# Altium project Crawler_V2.0.PrjPcb
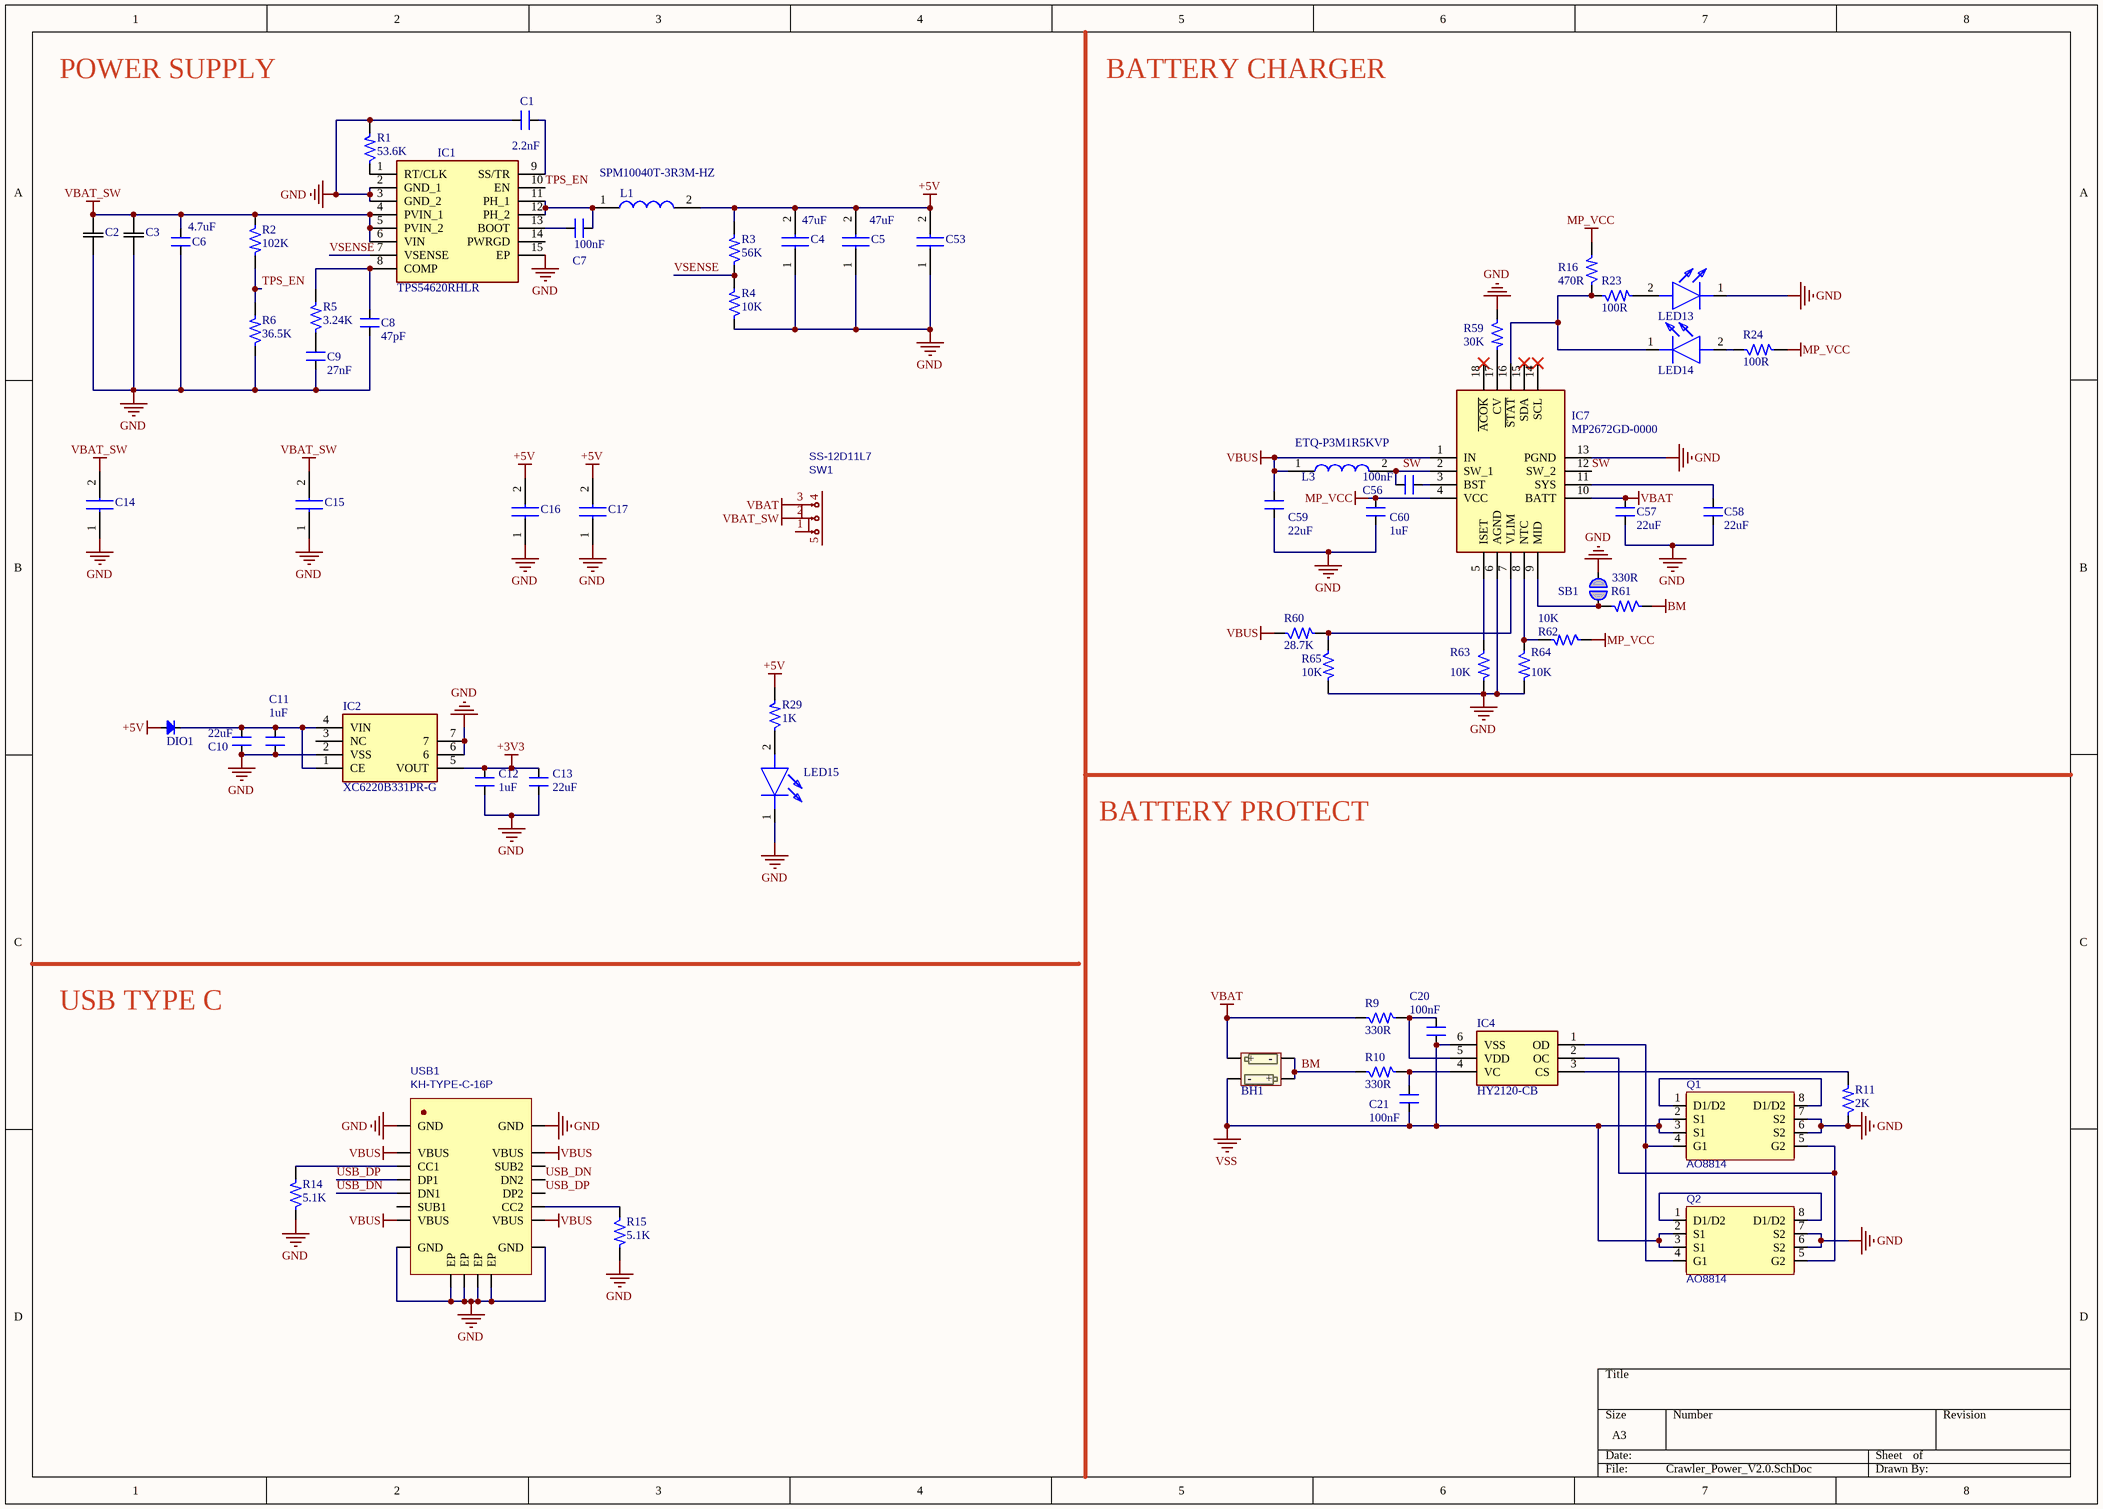
[diagram p0: Crawler_Power_V2.0.SchDoc]
2 sheets, 143 parts. Net scope: global (net labels, ports and power ports of the same name join across sheets).
Board file: Crawler_PCB_V2.0.PcbDoc
Sheets:
  Crawler_Power_V2.0.SchDoc
  Crawler_Sensor_V2.0.SchDoc

## Sheet Crawler_Power_V2.0.SchDoc
size A3; SheetNumber: 1; SheetTotal: 2

### Parts
BH1  Battery Holder  [BH-18650-B1BA007]  (value not drawn)
C1  2.2nF  [CAP_0402]
C2  CC1206MKX5R7BB106  [CAP_CC1206_YAG-M]  (value not drawn)
C3  CC1206MKX5R7BB106  [CAP_CC1206_YAG-M]  (value not drawn)
C4  GRM32ER61C476KE15L  [CAPC3225X270N]  (value not drawn)
C5  GRM32ER61C476KE15L  [CAPC3225X270N]  (value not drawn)
C6  4.7uF  [CAP_0402]
C7  100nF  [CAP_0603]
C8  47pF  [CAP_0402]
C9  27nF  [CAP_0402]
C10  22uF  [CAP_0603]
C11  1uF  [CAP_0402]
C12  1uF  [CAP_0402]
C13  22uF  [CAP_0603]
C14  GRM32ER61C476KE15L  [CAPC3225X270N]  (value not drawn)
C15  GRM32ER61C476KE15L  [CAPC3225X270N]  (value not drawn)
C16  GRM32ER61C476KE15L  [CAPC3225X270N]  (value not drawn)
C17  GRM32ER61C476KE15L  [CAPC3225X270N]  (value not drawn)
C20  100nF  [CAP_0402]
C21  100nF  [CAP_0402]
C53  GRM32ER61C476KE15L  [CAPC3225X270N]  (value not drawn)
C56  100nF  [CAP_0603]
C57  22uF  [CAP_0805]
C58  22uF  [CAP_0805]
C59  22uF  [CAP_0603]
C60  1uF  [CAP_0402]
DIO1  Diode SMD  [DIO-SMD-123]  (value not drawn)
IC1  TPS54620RHLR  [TPS54622RHLR]
IC2  XC6220B331PR-G  [XC6220B331PRG]
IC4  HY2120-CB  [SOT95P280X140-6N]
IC7  MP2672GD-0000  [QFN40P200X300X100-18N-D]
L1  SPM10040T-3R3M-HZ  [SPM10040]
L3  ETQ-P3M1R5KVP  [ETQ-P3M_KVP]
LED13  LTST-C191KGKT  [LEDC1608X55N]  (value not drawn)
LED14  LTST-C190KRKT  [LEDC1608X80N]  (value not drawn)
LED15  LTST-C191KGKT  [LEDC1608X55N]  (value not drawn)
Q1  AO8814  [TSSOP-8_L4.4-W3.0-P0.65-LS6.4-BL]
Q2  AO8814  [TSSOP-8_L4.4-W3.0-P0.65-LS6.4-BL]
R1  53.6K  [RES_0402]
R2  102K  [RES_0402]
R3  56K  [RES_0402]
R4  10K  [RES_0402]
R5  3.24K  [RES_0402]
R6  36.5K  [RES_0402]
R9  330R  [RES_0402]
R10  330R  [RES_0402]
R11  2K  [RES_0402]
R14  5.1K  [RES_0402]
R15  5.1K  [RES_0402]
R16  470R  [RES_0402]
R23  100R  [RES_0402]
R24  100R  [RES_0402]
R29  1K  [RES_0402]
R59  30K  [RES_0402]
R60  28.7K  [RES_0402]
R61  330R  [RES_0402]
R62  10K  [RES_0402]
R63  10K  [RES_0402]
R64  10K  [RES_0402]
R65  10K  [RES_0402]
SB1  Solderbridge  [Solderbridge]  (value not drawn)  (no BOM)
SW1  SS-12D11L7  [SW-TH_XKB_SS-12D11L7]
USB1  KH-TYPE-C-16P  [USB-C-SMD_KH-TYPE-C-16P]

### Nets
+3V3: C12.2 C13.2 IC2.5(VOUT)
+5V: C4.2 C5.2 C16.2 C17.2 C53.2 DIO1.1(A) L1.2 R3.2 R29.2
BM: BH1.2(-) BH1.4(+) R10.1 R61.1
GND: C1.2 C2.1 C3.1 C4.1 C5.1 C6.1 C8.1 C9.1 C10.1 C11.1 C12.1 C13.1 C14.1 C15.1 C16.1 C17.1 C53.1 C57.1 C58.1 C59.1 C60.1 IC1.2(GND_1) IC1.3(GND_2) IC1.15(EP) IC2.2(VSS) IC2.6 IC2.7 IC7.6(AGND) IC7.13(PGND) LED13.1(K) LED15.1(K) Q1.6(S2) Q1.7(S2) Q2.6(S2) Q2.7(S2) R1.2 R4.1 R6.1 R11.1 R14.1 R15.2 R59.1 R63.2 R64.2 R65.2 SB1.2 USB1.1(EP) USB1.2(EP) USB1.3(EP) USB1.4(EP) USB1.A1(GND) USB1.A12(GND) USB1.B1(GND) USB1.B12(GND)
MP_VCC: C60.2 IC7.4(VCC) R16.2 R24.2 R62.1
VBAT: BH1.1(+) C57.2 IC7.10(BATT) R9.1 SW1.3
VBAT_SW: C2.2 C3.2 C6.2 C14.2 C15.2 IC1.4(PVIN_1) IC1.5(PVIN_2) IC1.6(VIN) R2.1 SW1.2
VBUS: C59.2 IC7.1(IN) L3.1 R60.1 USB1.A4(VBUS) USB1.A9(VBUS) USB1.B4(VBUS) USB1.B9(VBUS)
VSS: BH1.3(-) C20.2 C21.1 IC4.6(VSS) Q1.2(S1) Q1.3(S1) Q2.2(S1) Q2.3(S1)
SW: C56.1 IC7.2(SW_1) IC7.12(SW_2) L3.2
TPS_EN: IC1.10(EN) R2.2 R6.2
USB_DN: USB1.A7(DN1) USB1.B7(DN2)
USB_DP: USB1.A6(DP1) USB1.B6(DP2)
VSENSE: IC1.7(VSENSE) R3.1 R4.2
NetC1_1: C1.1 IC1.9(SS/TR)
NetC7_1: C7.1 IC1.13(BOOT)
NetC7_2: C7.2 IC1.11(PH_1) IC1.12(PH_2) L1.1
NetC8_2: C8.2 IC1.8(COMP) R5.2
NetC9_2: C9.2 R5.1
NetC10_2: C10.2 C11.2 DIO1.2(K) IC2.1(CE) IC2.4(VIN)
NetC20_1: C20.1 IC4.5(VDD) R9.2
NetC21_2: C21.2 IC4.4(VC) R10.2
NetC56_2: C56.2 IC7.3(BST)
NetC58_2: C58.2 IC7.11(SYS)
NetIC1_1: IC1.1(RT/CLK) R1.1
NetIC4_1: IC4.1(OD) Q1.4(G1) Q2.4(G1)
NetIC4_2: IC4.2(OC) Q1.5(G2) Q2.5(G2)
NetIC4_3: IC4.3(CS) R11.2
NetIC7_5: IC7.5(ISET) R63.1
NetIC7_7: IC7.7(VLIM) R60.2 R65.1
NetIC7_8: IC7.8(NTC) R62.2 R64.1
NetIC7_9: IC7.9(MID) R61.2 SB1.1
NetIC7_16: IC7.16(~{STAT}) LED14.1(K) R16.1 R23.1
NetIC7_17: IC7.17(CV) R59.2
NetLED13_2: LED13.2(A) R23.2
NetLED14_2: LED14.2(A) R24.1
NetLED15_2: LED15.2(A) R29.1
NetQ1_1: Q1.1(D1/D2) Q1.8(D1/D2)
NetQ2_1: Q2.1(D1/D2) Q2.8(D1/D2)
NetR14_2: R14.2 USB1.A5(CC1)
NetR15_1: R15.1 USB1.B5(CC2)

Not connected (* = marked no-connect by the designer): IC1 14(PWRGD); IC2 3(NC); IC7 14(SCL)* 15(SDA)* 18(~{ACOK})*; SW1 1 4 5; USB1 A8(SUB1) B8(SUB2)

### Notes on the sheet
- POWER SUPPLY
- BATTERY CHARGER
- (near C4) 47uF
- (near C5) 47uF
- BATTERY PROTECT
- USB TYPE C

### Library data of the parts
BH1 = BH-18650-B1BA007
C1 = CAP_220pF-10V-10%-0402: 2.2nF ±10% 50V Ceramic Capacitor X7R 0402 (1005 Metric); Manufacturer: KEMET; Manufacturer Part Number: C0402C221K8RAC7867; Case/Package: 0402; Supplier-1: Digikey
C2 C3 = CC1206MKX5R7BB106: No Description Available; Mfr_Name: Yageo; Type: DEV; Copyright: Copyright (C) 2023 Ultra Librarian. All rights reserved.; Manufacturer_Part_Number: CC1206MKX5R7BB106; Digi-Key_Part_Number_1: 311-1996-2-ND; Digi-Key_Part_Number_2: 311-1996-1-ND; Digi-Key_Part_Number_3: 311-1996-6-ND; RefDes: RefDes
C4 C5 C14-C17 C53 = GRM32ER61C476KE15L: Capacitor; Manufacturer_Name: Murata Electronics; Datasheet Link: http://psearch.en.murata.com/capacitor/product/GRM32ER71E226KE15%23.pdf; Height: 2.7mm; Manufacturer_Part_Number: GRM32ER61C476KE15L; Arrow Part Number: GRM32ER61C476KE15L; Arrow Price/Stock: https://www.arrow.com/en/products/grm32er61c476ke15l/murata-manufacturing; Mouser Part Number: 81-GRM32ER61C476KE5L; Mouser Price/Stock: https://www.mouser.co.uk/ProductDetail/Murata-Electronics/GRM32ER61C476KE15L?qs=%252B%2F7tQhzlcy7Im%2F1Gh2YSGQ%3D%3D
C6 = CAP_4.7uF-10V-10%-0402: 4.7µF ±10% 10V Ceramic Capacitor X5R 0402 (1005 Metric); Manufacturer: Samsung Electro-Mechanics; Manufacturer Part Number: CL05A475KP5NRNC; Case/Package: 0402; Supplier-1: Digikey
C7 C56 = CAP_100nF-10V-5%-0603: 25V 100nF X7R ±10% 0603 Multilayer Ceramic Capacitors MLCC - SMD/SMT ROHS; Manufacturer: Yageo; Manufacturer Part Number: CC0603KRX7R6BB104; Case/Package: 0603; Supplier-1: Digikey
C8 = CAP_220pF-10V-10%-0402: 82pF ±10% 50V Ceramic Capacitor NP0 0402 (1005 Metric); Manufacturer: KEMET; Manufacturer Part Number: C0402C221K8RAC7867; Case/Package: 0402; Supplier-1: Digikey
C9 = CAP_220pF-10V-10%-0402: 27nF ±10% 50V Ceramic Capacitor X7R 0402 (1005 Metric); Manufacturer: KEMET; Manufacturer Part Number: C0402C221K8RAC7867; Case/Package: 0402; Supplier-1: Digikey
C10 C13 C59 = CAP_22uF-10V-20%-0603: 22µF ±20% 10V Ceramic Capacitor X5R 0603 (1608 Metric); Manufacturer: Murata Electronics; Manufacturer Part Number: GRM188R61A226ME15D; Case/Package: 0603; Supplier-1: Digikey
C11 C12 C60 = CAP_1uF-10V-10%-0402: 1µF ±10% 10V Ceramic Capacitor X6S 0402 (1005 Metric); Manufacturer: Murata Electronics; Manufacturer Part Number: GRT155C81A105KE01D; Case/Package: 0402; Supplier-1: Digikey
C20 C21 = CAP_100nF-25V-10%-0402: 0.1µF ±10% 25V Ceramic Capacitor X7R 0402 (1005 Metric); Manufacturer: Walsin Technology Corporation; Manufacturer Part Number: 0402B104K250CT; Case/Package: 0402; Supplier-1: Digikey
C57 C58 = CAP_22uF-25V-20%-0805: 22µF ±20% 25V Ceramic Capacitor X5R 0805 (2012 Metric); Manufacturer: Murata Electronics; Manufacturer Part Number: GRM21BR61E226ME44K; Case/Package: 0805; Supplier-1: Digikey
DIO1 = Diode SMD: Default Diode; Code - JEDEC: DO-214-AB; Value: 1N5007; Published: 8-Jun-2000; Revision: July-2002: Re-released for DXP Platform.; Publisher: Altium Limited
IC1 = TPS54620RHLR: Integrated Circuit; Manufacturer_Name: Texas Instruments; Datasheet Link: http://www.ti.com/lit/ds/symlink/tps54620.pdf; Manufacturer_Part_Number: TPS54620RHLR; Mouser Part Number: 595-TPS54620RHLR; Mouser Price/Stock: https://www.mouser.co.uk/ProductDetail/Texas-Instruments/TPS54620RHLR?qs=g5raLcSarOavNbXjatBJuw%3D%3D; Arrow Part Number: TPS54620RHLR; Arrow Price/Stock: https://www.arrow.com/en/products/tps54620rhlr/texas-instruments?region=nac
IC2 = XC6220B331PR-G: Integrated Circuit; Manufacturer_Name: Torex; Datasheet Link: https://www.torexsemi.com/file/xc6220/XC6220.pdf; Height: 1.6mm; Manufacturer_Part_Number: XC6220B331PR-G; Mouser Part Number: 865-XC6220B331PR-G; Mouser Price/Stock: https://www.mouser.co.uk/ProductDetail/Torex-Semiconductor/XC6220B331PR-G?qs=AsjdqWjXhJ9%2FMkHVs5v3gw%3D%3D
IC4 = HY2120-CB: Integrated Circuit; Manufacturer_Name: Hycon; Datasheet Link: https://datasheet.lcsc.com/szlcsc/HYCON-Tech-HY2120CB_C116509.pdf; Height: 1.4mm; Manufacturer_Part_Number: HY2120-CB
IC7 = MP2672GD-0000: Integrated Circuit; Manufacturer_Name: Monolithic Power Systems (MPS); Height: 1mm; Manufacturer_Part_Number: MP2672GD-0000
L1 = SPM10040T-3R3M-HZ: Inductor; Manufacturer_Name: TDK; Datasheet Link: https://product.tdk.com/system/files/dam/doc/product/inductor/inductor/smd/catalog/inductor_automotive_power_spm10040-hz_en.pdf; Manufacturer_Part_Number: SPM10040T-3R3M-HZ; Mouser Part Number: 810-SPM10040T-3R3HZ; Mouser Price/Stock: https://www.mouser.co.uk/ProductDetail/TDK/SPM10040T-3R3M-HZ?qs=y6ZabgHbY%252BwBR7hmhWa%252BrA%3D%3D; Arrow Part Number: SPM10040T-3R3M-HZ; Arrow Price/Stock: https://www.arrow.com/en/products/spm10040t-3r3m-hz/tdk?region=nac
L3 = ETQ-P3M1R5KVP: Inductor; Manufacturer_Name: Panasonic; Datasheet Link: http://industrial.panasonic.com/cdbs/www-data/pdf/AGL0000/AGL0000C63.pdf; Height: 3mm; Manufacturer_Part_Number: ETQ-P3M1R5KVP; Mouser Part Number: 667-ETQ-P3M1R5KVP; Mouser Price/Stock: https://www.mouser.co.uk/ProductDetail/Panasonic/ETQ-P3M1R5KVP?qs=DddhjTRTMKyw4jpGRX4KaA%3D%3D; Arrow Part Number: ETQ-P3M1R5KVP; Arrow Price/Stock: https://www.arrow.com/en/products/etq-p3m1r5kvp/panasonic
LED13 LED15 = LTST-C191KGKT: LED GREEN; Manufacturer_Name: Lite-On; Datasheet Link: http://www.mouser.com/ds/2/239/S_110_LTST-C191KGKT-369560.pdf; Height: 0.55mm; Manufacturer_Part_Number: LTST-C191KGKT; Mouser Part Number: 859-LTST-C191KGKT; Mouser Price/Stock: https://www.mouser.co.uk/ProductDetail/Lite-On/LTST-C191KGKT?qs=xSPZu9B1aMCRQ5ACasEYAg%3D%3D; Arrow Part Number: LTST-C191KGKT; Arrow Price/Stock: https://www.arrow.com/en/products/ltst-c191kgkt/lite-on-technology?region=nac
LED14 = LTST-C190KRKT: LED RED; Manufacturer_Name: Lite-On; Datasheet Link: https://componentsearchengine.com/Datasheets/1/LTST-C190KRKT.pdf; Height: 0.8mm; Manufacturer_Part_Number: LTST-C190KRKT; Mouser Part Number: 859-LTST-C190KRKT; Mouser Price/Stock: https://www.mouser.co.uk/ProductDetail/Lite-On/LTST-C190KRKT?qs=kAD5fFa1n5VY3YYNWPC1Fg%3D%3D; Arrow Part Number: LTST-C190KRKT; Arrow Price/Stock: https://www.arrow.com/en/products/ltst-c190krkt/lite-on-technology?region=europe
Q1 Q2 = AO8814: BOM_Manufacturer: AOS; Contributor: LCSC; BOM_Supplier: LCSC; BOM_Supplier Part: C357843; BOM_Manufacturer Part: AO8814; BOM_JLCPCB Part Class: Extended Part; spicePre: Q; spiceSymbolName: AO8814
R1 = RES_300K-0.1W-1%-0402: 53.6 kOhms ±1% 0.1W, 1/10W Chip Resistor 0402 (1005 Metric) Automotive AEC-Q200 Thick Film; Manufacturer: Panasonic Electronic Components; Manufacturer Part Number: ERJ-2RKF3003X; Case/Package: 0402; Supplier-1: Digikey
R2 = RES_300K-0.1W-1%-0402: 102 kOhms ±1% 0.1W, 1/10W Chip Resistor 0402 (1005 Metric) Automotive AEC-Q200 Thick Film; Manufacturer: Panasonic Electronic Components; Manufacturer Part Number: ERJ-2RKF3003X; Case/Package: 0402; Supplier-1: Digikey
R3 = RES_51K-0.1W-1%-0402: 56 kOhms ±1% 0.1W, 1/10W Chip Resistor 0402 (1005 Metric) Automotive AEC-Q200 Thick Film; Manufacturer: Panasonic Electronic Components; Manufacturer Part Number: ERJ-2RKF5102X; Case/Package: 0402; Supplier-1: Digikey
R4 R62-R65 = RES_10K-0.1W-1%-0402: 10 kOhms ±1% 0.1W, 1/10W Chip Resistor 0402 (1005 Metric) Anti-Sulfur Thin Film; Manufacturer: Vishay Beyschlag/Draloric/BC Components; Manufacturer Part Number: MCS04020C1002FE000; Case/Package: 0402; Supplier-1: Digikey
R5 = RES_300K-0.1W-1%-0402: 3.24 kOhms ±1% 0.1W, 1/10W Chip Resistor 0402 (1005 Metric) Automotive AEC-Q200 Thick Film; Manufacturer: Panasonic Electronic Components; Manufacturer Part Number: ERJ-2RKF3003X; Case/Package: 0402; Supplier-1: Digikey
R6 = RES_300K-0.1W-1%-0402: 28.7 kOhms ±1% 0.1W, 1/10W Chip Resistor 0402 (1005 Metric) Automotive AEC-Q200 Thick Film; Manufacturer: Panasonic Electronic Components; Manufacturer Part Number: ERJ-2RKF3003X; Case/Package: 0402; Supplier-1: Digikey
R9 R10 R61 = RES_300K-0.1W-1%-0402: 330 Ohms ±1% 0.1W, 1/10W Chip Resistor 0402 (1005 Metric) Automotive AEC-Q200 Thick Film; Manufacturer: Panasonic Electronic Components; Manufacturer Part Number: ERJ-2RKF3003X; Case/Package: 0402; Supplier-1: Digikey
R11 = RES_200K-0.1W-1%-0402: 2 kOhms ±1% 0.1W, 1/10W Chip Resistor 0402 (1005 Metric) Automotive AEC-Q200 Thick Film; Manufacturer: Panasonic Electronic Components; Manufacturer Part number: ERJ-2RKF2003X; Case/Package: 0402; Supplier-1: Digikey
R14 R15 = RES_5.6K-0.1W-1%-0402: 5.1 kOhms ±1% 0.1W, 1/10W Chip Resistor 0402 (1005 Metric) Automotive AEC-Q200, Moisture Resistant Thick Film; Manufacturer: KOA Speer Electronics, Inc.; Manufacturer Part Number: RK73H1ETTP5601F; Case/Package: 0402; Supplier-1: Digikey
R16 = RES_100R-0.1W-1%-0402: 470 Ohms ±1% 0.1W, 1/10W Chip Resistor 0402 (1005 Metric) Automotive AEC-Q200, Moisture Resistant Thick Film; Manufacturer: KOA Speer Electronics, Inc.; Manufacturer Part Number: RK73H1ETTP1000F; Case/Package: 0402; Supplier-1: Digikey
R23 R24 = RES_100R-0.1W-1%-0402: 100 Ohms ±1% 0.1W, 1/10W Chip Resistor 0402 (1005 Metric) Automotive AEC-Q200, Moisture Resistant Thick Film; Manufacturer: KOA Speer Electronics, Inc.; Manufacturer Part Number: RK73H1ETTP1000F; Case/Package: 0402; Supplier-1: Digikey
R29 = RES_1K-0.1W-1%-0402: 1 kOhms ±1% 0.1W, 1/10W Chip Resistor 0402 (1005 Metric) Anti-Sulfur Thin Film; Manufacturer: Vishay Beyschlag/Draloric/BC Components; Manufacturer Part Number: MCS04020C1001FE000; Case/Package: 0402; Supplier-1: Digikey
R59 = RES_10K-0.1W-1%-0402: 30 kOhms ±1% 0.1W, 1/10W Chip Resistor 0402 (1005 Metric) Anti-Sulfur Thin Film; Manufacturer: Vishay Beyschlag/Draloric/BC Components; Manufacturer Part Number: MCS04020C1002FE000; Case/Package: 0402; Supplier-1: Digikey
R60 = RES_10K-0.1W-1%-0402: 28.7 kOhms ±1% 0.1W, 1/10W Chip Resistor 0402 (1005 Metric) Anti-Sulfur Thin Film; Manufacturer: Vishay Beyschlag/Draloric/BC Components; Manufacturer Part Number: MCS04020C1002FE000; Case/Package: 0402; Supplier-1: Digikey
SB1 = SOLDERBRIDGE: Artikkelnr Noca: N.A.; Part Number: Solderbridge; Manufacturer: *; Manufacturer Part Number: *; LatestRevisionDate: 2009-12-14; Pin Count: 2; Publisher: Nordic Semiconductor; Published: 2009-12-14; Value: Solderbridge; Note: *; Footprint Doc: Solderbridge; Part number IPS: N.A.; ComponentLink1URL: *; ComponentLink1Description: Datasheet; ComponentLink2URL: *; ComponentLink2Description: Supplier link; HelpURL: *; Supplier 1: *; Supplier Part Number 1: *; Supplier 2: *; Supplier Part Number 2: *
SW1 = SS-12D11L7: BOM_Manufacturer: XKB Connectivity(中国星坤); Contributor: LCSC; BOM_Supplier: LCSC; BOM_Supplier Part: C2884775; BOM_Manufacturer Part: SS-12D11L7; BOM_JLCPCB Part Class: Extended Part; spicePre: S; spiceSymbolName: SS-12D11L7
USB1 = KH-TYPE-C-16P: BOM_Manufacturer: kinghelm(金航标); Contributor: LCSC; BOM_Supplier: LCSC; BOM_Supplier Part: C709357; BOM_Manufacturer Part: KH-TYPE-C-16P; BOM_JLCPCB Part Class: Extended Part; spicePre: U; spiceSymbolName: KH-TYPE-C-16P

## Sheet Crawler_Sensor_V2.0.SchDoc
size A3; SheetNumber: 2; SheetTotal: 2
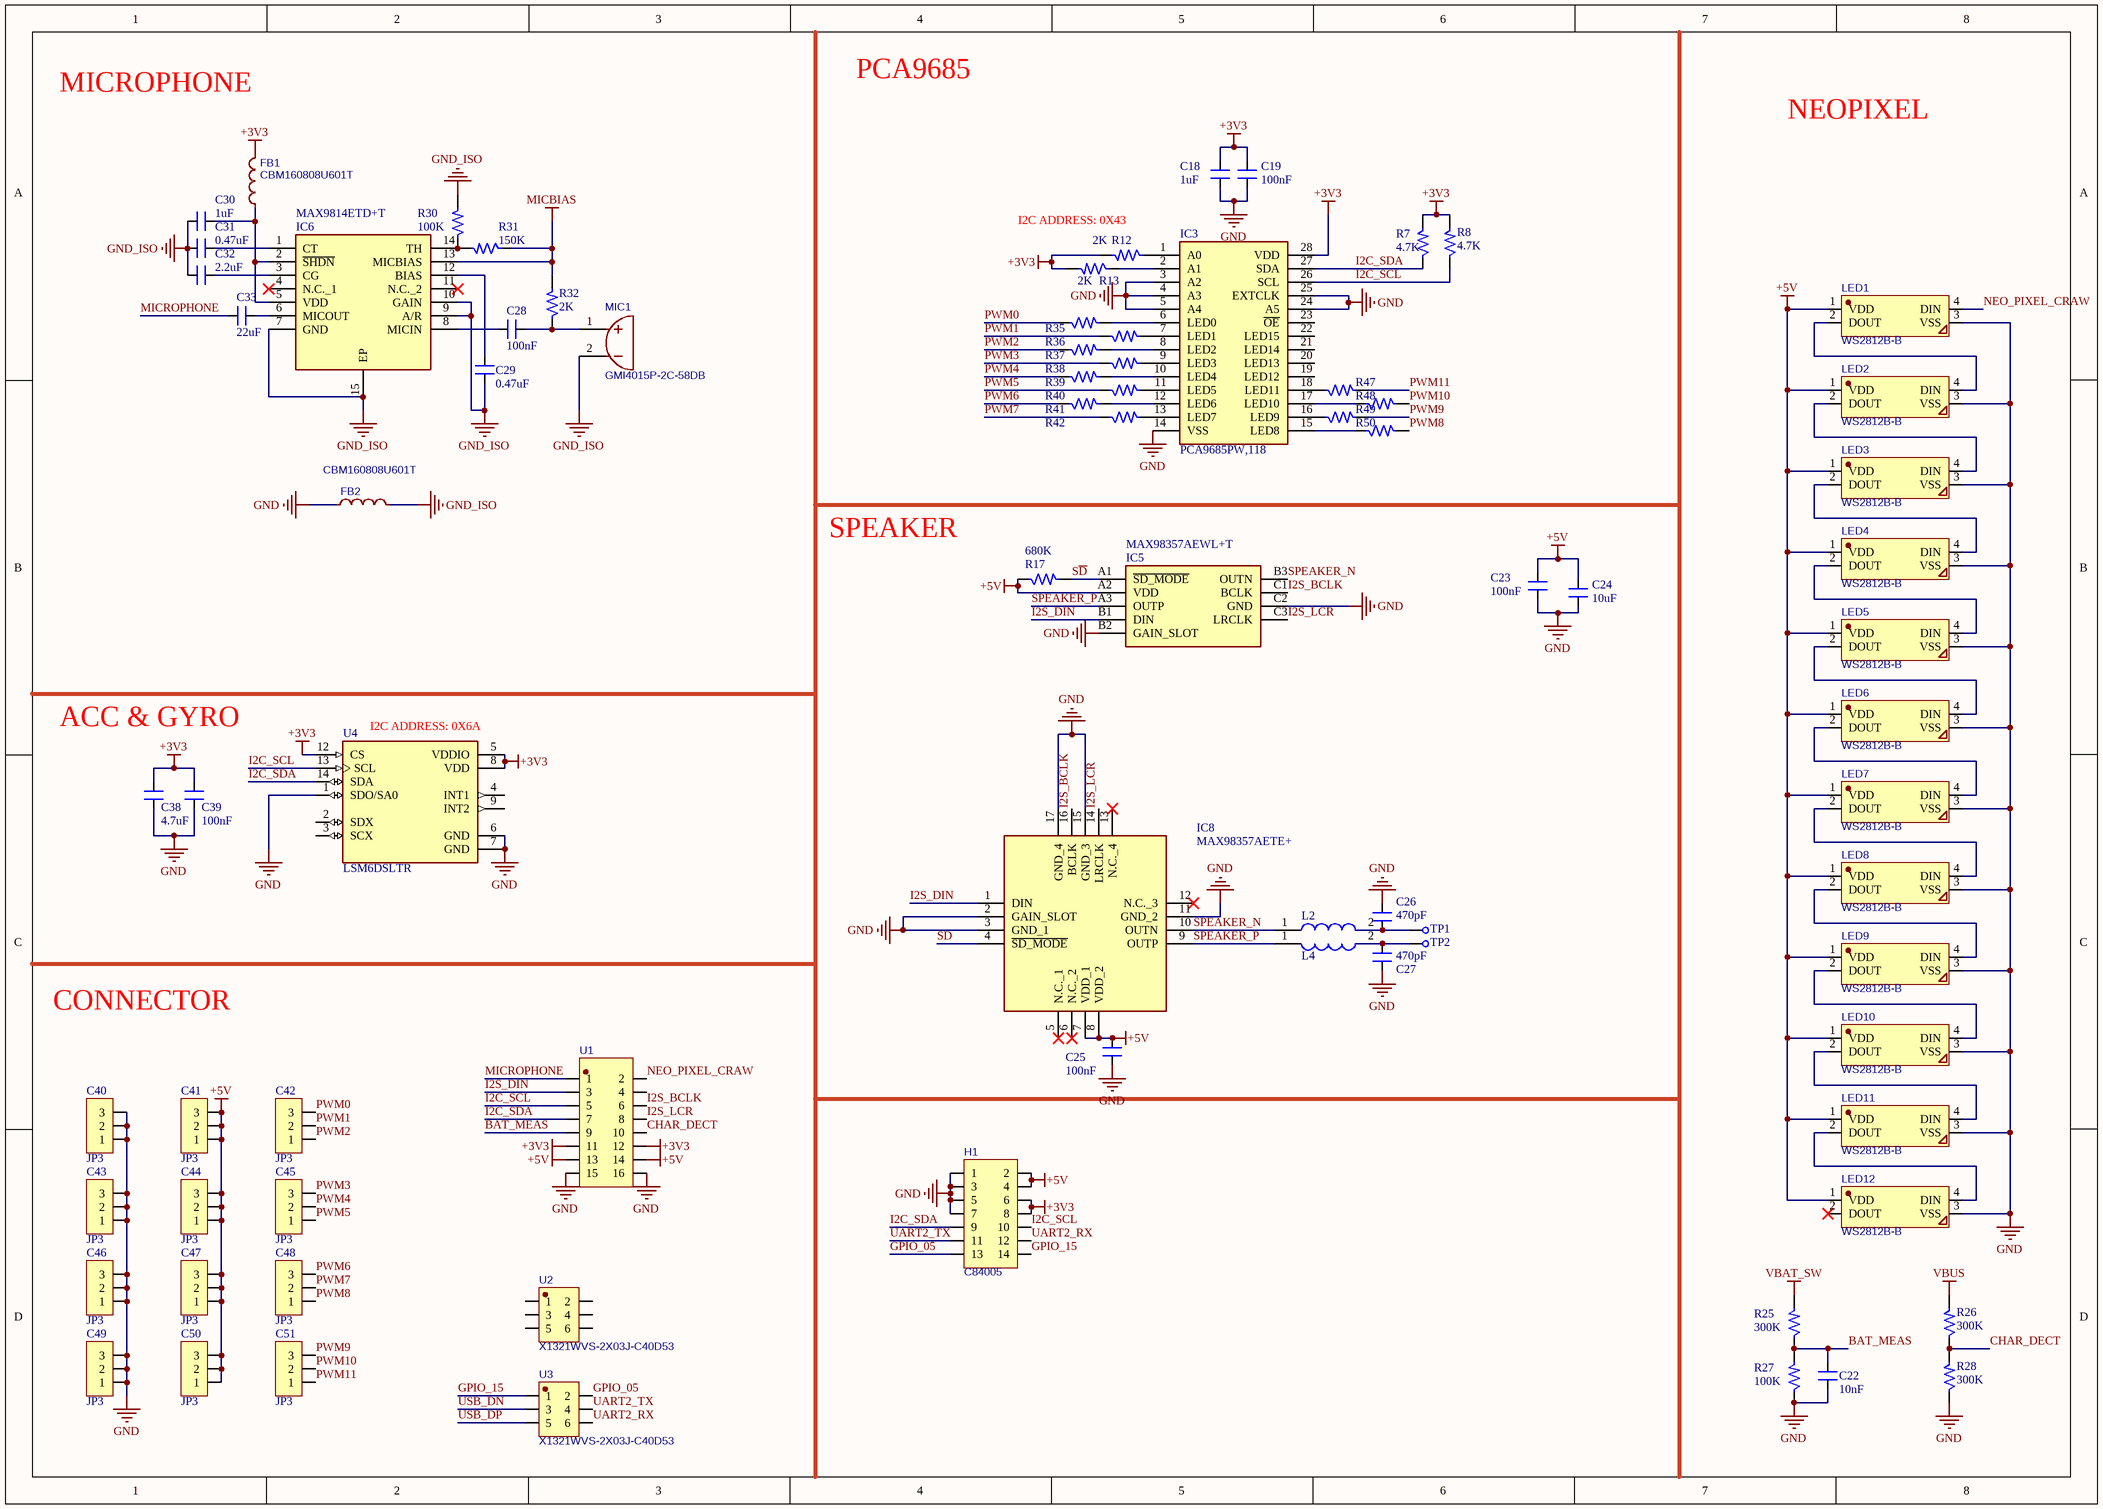
[diagram p1: Crawler_Sensor_V2.0.SchDoc]

### Parts
C18  1uF  [CAP_0402]
C19  100nF  [CAP_0402]
C22  10nF  [CAP_0402]
C23  100nF  [CAP_0402]
C24  10uF  [CAP_0402]
C25  100nF  [CAP_0402]
C26  470pF  [CAP_0402]
C27  470pF  [CAP_0402]
C28  100nF  [CAP_0402]
C29  0.47uF  [CAP_0402]
C30  1uF  [CAP_0402]
C31  0.47uF  [CAP_0402]
C32  2.2uF  [CAP_0402]
C33  22uF  [CAP_0603]
C38  4.7uF  [CAP_0402]
C39  100nF  [CAP_0402]
C40  JP3  [JP3-D1T]
C41  JP3  [JP3-D1T]
C42  JP3  [JP3-D1T]
C43  JP3  [JP3-D1T]
C44  JP3  [JP3-D1T]
C45  JP3  [JP3-D1T]
C46  JP3  [JP3-D1T]
C47  JP3  [JP3-D1T]
C48  JP3  [JP3-D1T]
C49  JP3  [JP3-D1T]
C50  JP3  [JP3-D1T]
C51  JP3  [JP3-D1T]
FB1  CBM160808U601T  [L0603]
FB2  CBM160808U601T  [L0603]
H1  C84005  [HDR-SMD_14P-P2.54-V-F-R2-C7-S2.54]
IC3  PCA9685PW,118  [SOP65P640X110-28N]
IC5  MAX98357AEWL+T  [BGA9C40P3X3_144X135X69]
IC6  MAX9814ETD+T  [SON40P300X300X80-15N]
IC8  MAX98357AETE+  [QFN50P300X300X80-17N]
L2  MLF2012C680KT000  [INDC2012X145N]  (value not drawn)
L4  MLF2012C680KT000  [INDC2012X145N]  (value not drawn)
LED1  WS2812B-B  [LED-SMD_4P-L5.0-W5.0-BL_TC5050RGB]
LED2  WS2812B-B  [LED-SMD_4P-L5.0-W5.0-BL_TC5050RGB]
LED3  WS2812B-B  [LED-SMD_4P-L5.0-W5.0-BL_TC5050RGB]
LED4  WS2812B-B  [LED-SMD_4P-L5.0-W5.0-BL_TC5050RGB]
LED5  WS2812B-B  [LED-SMD_4P-L5.0-W5.0-BL_TC5050RGB]
LED6  WS2812B-B  [LED-SMD_4P-L5.0-W5.0-BL_TC5050RGB]
LED7  WS2812B-B  [LED-SMD_4P-L5.0-W5.0-BL_TC5050RGB]
LED8  WS2812B-B  [LED-SMD_4P-L5.0-W5.0-BL_TC5050RGB]
LED9  WS2812B-B  [LED-SMD_4P-L5.0-W5.0-BL_TC5050RGB]
LED10  WS2812B-B  [LED-SMD_4P-L5.0-W5.0-BL_TC5050RGB]
LED11  WS2812B-B  [LED-SMD_4P-L5.0-W5.0-BL_TC5050RGB]
LED12  WS2812B-B  [LED-SMD_4P-L5.0-W5.0-BL_TC5050RGB]
MIC1  GMI4015P-2C-58DB  [MIC-TH_BD4.0-P1.40-D0.4-L-FD]
R7  4.7K  [RES_0402]
R8  4.7K  [RES_0402]
R12  2K  [RES_0402]
R13  2K  [RES_0402]
R17  680K  [RES_0402]
R25  300K  [RES_0402]
R26  300K  [RES_0402]
R27  100K  [RES_0402]
R28  300K  [RES_0402]
R30  100K  [RES_0402]
R31  150K  [RES_0402]
R32  2K  [RES_0402]
R35  220R  [RES_0402]  (value not drawn)
R36  220R  [RES_0402]  (value not drawn)
R37  220R  [RES_0402]  (value not drawn)
R38  220R  [RES_0402]  (value not drawn)
R39  220R  [RES_0402]  (value not drawn)
R40  220R  [RES_0402]  (value not drawn)
R41  220R  [RES_0402]  (value not drawn)
R42  220R  [RES_0402]  (value not drawn)
R47  220R  [RES_0402]  (value not drawn)
R48  220R  [RES_0402]  (value not drawn)
R49  220R  [RES_0402]  (value not drawn)
R50  220R  [RES_0402]  (value not drawn)
TP1  TEST POINT  [TEST POINT_30]  (value not drawn)
TP2  TEST POINT  [TEST POINT_30]  (value not drawn)
U1  X1321WVS-2X08J-C40D53  [HDR-SMD_16P-P1.27-V-M-R2-C8-LS5.3]  (value not drawn)
U2  X1321WVS-2X03J-C40D53  [HDR-SMD_6P-P1.27-V-M-R2-C3-LS5.3]
U3  X1321WVS-2X03J-C40D53  [HDR-SMD_6P-P1.27-V-M-R2-C3-LS5.3]
U4  LSM6DSLTR  [PQFN50P300X250X86-14N]

### Nets
+3V3: C18.2 C19.2 C38.2 C39.2 FB1.2 H1.6 H1.8 IC3.28(VDD) R7.2 R8.2 R12.2 R13.2 U1.11 U1.12 U4.5(VDDIO) U4.8(VDD) U4.12(CS)
+5V: C23.2 C24.2 C25.2 C41.1 C41.2 C41.3 C44.1 C44.2 C44.3 C47.1 C47.2 C47.3 C50.1 C50.2 C50.3 H1.2 H1.4 IC5.A2(VDD) IC8.7(VDD_1) IC8.8(VDD_2) LED1.1(VDD) LED2.1(VDD) LED3.1(VDD) LED4.1(VDD) LED5.1(VDD) LED6.1(VDD) LED7.1(VDD) LED8.1(VDD) LED9.1(VDD) LED10.1(VDD) LED11.1(VDD) LED12.1(VDD) R17.1 U1.13 U1.14
GND: C18.1 C19.1 C22.1 C23.1 C24.1 C25.1 C26.2 C27.1 C38.1 C39.1 C40.1 C40.2 C40.3 C43.1 C43.2 C43.3 C46.1 C46.2 C46.3 C49.1 C49.2 C49.3 FB2.1 H1.1 H1.3 H1.5 H1.7 IC3.3(A2) IC3.4(A3) IC3.5(A4) IC3.14(VSS) IC3.24(A5) IC3.25(EXTCLK) IC5.B2(GAIN_SLOT) IC5.C2(GND) IC8.2(GAIN_SLOT) IC8.3(GND_1) IC8.11(GND_2) IC8.15(GND_3) IC8.17(GND_4) LED1.3(VSS) LED2.3(VSS) LED3.3(VSS) LED4.3(VSS) LED5.3(VSS) LED6.3(VSS) LED7.3(VSS) LED8.3(VSS) LED9.3(VSS) LED10.3(VSS) LED11.3(VSS) LED12.3(VSS) R27.1 R28.1 U1.15 U1.16 U4.1(SDO/SA0) U4.6(GND) U4.7(GND)
GND_ISO: C29.1 C30.1 C31.2 C32.1 FB2.2 IC6.7(GND) IC6.9(A/R) IC6.10(GAIN) IC6.15(EP) MIC1.2 R30.2
MICBIAS: IC6.13(MICBIAS) R31.1 R32.2
VBAT_SW: R25.2
VBUS: R26.2
BAT_MEAS: C22.2 R25.1 R27.2 U1.9
CHAR_DECT: R26.1 R28.2 U1.10
GPIO_05: H1.13 U3.2
GPIO_15: H1.14 U3.1
I2C_SCL: H1.10 IC3.26(SCL) R8.1 U1.5 U4.13(SCL)
I2C_SDA: H1.9 IC3.27(SDA) R7.1 U1.7 U4.14(SDA)
I2S_BCLK: IC5.C1(BCLK) IC8.16(BCLK) U1.6
I2S_DIN: IC5.B1(DIN) IC8.1(DIN) U1.3
I2S_LCR: IC5.C3(LRCLK) IC8.14(LRCLK) U1.8
MICROPHONE: C33.1 U1.1
NEO_PIXEL_CRAW: LED1.4(DIN) U1.2
PWM0: C42.3 R35.1
PWM1: C42.2 R36.1
PWM2: C42.1 R37.1
PWM3: C45.3 R38.1
PWM4: C45.2 R39.1
PWM5: C45.1 R40.1
PWM6: C48.3 R41.1
PWM7: C48.2 R42.1
PWM8: C48.1 R50.2
PWM9: C51.3 R49.2
PWM10: C51.2 R48.2
PWM11: C51.1 R47.2
S~{D}: IC5.A1(~{SD_MODE}) IC8.4(~{SD_MODE}) R17.2
SPEAKER_N: IC5.B3(OUTN) IC8.10(OUTN) L2.1
SPEAKER_P: IC5.A3(OUTP) IC8.9(OUTP) L4.1
UART2_RX: H1.12 U3.6
UART2_TX: H1.11 U3.4
USB_DN: U3.3
USB_DP: U3.5
NetC26_1: C26.1 L2.2 TP1.1
NetC27_2: C27.2 L4.2 TP2.1
NetC28_1: C28.1 IC6.8(MICIN)
NetC28_2: C28.2 MIC1.1 R32.1
NetC29_2: C29.2 IC6.12(BIAS)
NetC30_2: C30.2 FB1.1 IC6.2(~{SHDN}) IC6.5(VDD)
NetC31_1: C31.1 IC6.1(CT)
NetC32_2: C32.2 IC6.3(CG)
NetC33_2: C33.2 IC6.6(MICOUT)
NetIC3_1: IC3.1(A0) R12.1
NetIC3_2: IC3.2(A1) R13.1
NetIC3_6: IC3.6(LED0) R35.2
NetIC3_7: IC3.7(LED1) R36.2
NetIC3_8: IC3.8(LED2) R37.2
NetIC3_9: IC3.9(LED3) R38.2
NetIC3_10: IC3.10(LED4) R39.2
NetIC3_11: IC3.11(LED5) R40.2
NetIC3_12: IC3.12(LED6) R41.2
NetIC3_13: IC3.13(LED7) R42.2
NetIC3_15: IC3.15(LED8) R50.1
NetIC3_16: IC3.16(LED9) R49.1
NetIC3_17: IC3.17(LED10) R48.1
NetIC3_18: IC3.18(LED11) R47.1
NetIC6_14: IC6.14(TH) R30.1 R31.2
NetLED1_2: LED1.2(DOUT) LED2.4(DIN)
NetLED2_2: LED2.2(DOUT) LED3.4(DIN)
NetLED3_2: LED3.2(DOUT) LED4.4(DIN)
NetLED4_2: LED4.2(DOUT) LED5.4(DIN)
NetLED5_2: LED5.2(DOUT) LED6.4(DIN)
NetLED6_2: LED6.2(DOUT) LED7.4(DIN)
NetLED7_2: LED7.2(DOUT) LED8.4(DIN)
NetLED8_2: LED8.2(DOUT) LED9.4(DIN)
NetLED9_2: LED9.2(DOUT) LED10.4(DIN)
NetLED10_2: LED10.2(DOUT) LED11.4(DIN)
NetLED11_2: LED11.2(DOUT) LED12.4(DIN)

Not connected (* = marked no-connect by the designer): IC3 19(LED12) 20(LED13) 21(LED14) 22(LED15) 23(~{OE}); IC6 4(N.C._1)* 11(N.C._2)*; IC8 5(N.C._1)* 6(N.C._2)* 12(N.C._3)* 13(N.C._4)*; LED12 2(DOUT)*; U1 4; U2 1 2 3 4 5 6; U4 2(SDX) 3(SCX) 4(INT1) 9(INT2)

### Notes on the sheet
- MICROPHONE
- PCA9685
- NEOPIXEL
- I2C ADDRESS: 0X43
- SPEAKER
- ACC & GYRO
- (near U4) I2C ADDRESS: 0X6A
- CONNECTOR
- Responsibility
- Name
- Date
- PROJECT CODE:
- PROJECT NAME:
- Engineer
- Approved
- Checked
- DRAWING NUMBER:
- Zone
- Revision
- Reason
- Revision Table
- REVISION:
- Sheet of:
- /
- Sheet Type:
- Description:
- A4

### Library data of the parts
C18 = CAP_1uF-16V-10%-0402: 1µF ±10% 16V Ceramic Capacitor X5R 0402 (1005 Metric); Manufacturer: Knowles Novacap; Manufacturer Part Number: 0402BW105K160YT; Case/Package: 0402; Supplier-1: Digikey
C19 = CAP_100nF-25V-10%-0402: as C20 on sheet Crawler_Power_V2.0; Case/Package: 0402; Supplier-1: Digikey
C22 = CAP_10nF-10V-10%-0402: 10000pF ±10% 10V Ceramic Capacitor X7R 0402 (1005 Metric); Manufacturer: AVX Corporation; Manufacturer Part Number: 0402ZC103KAT2A; Case/Package: 0402; Supplier-1: Digikey
C23 C25 C28 C39 = CAP_100nF-10V-10%-0402: 0.1µF ±10% 10V Ceramic Capacitor X7R 0402 (1005 Metric); Manufacturer: Yageo; Manufacturer Part Number: CC0402KRX7R6BB104; Case/Package: 0402; Supplier-1: Digikey
C24 = CAP_10uF-10V-20%-0402: 10µF ±20% 10V Ceramic Capacitor X5R 0402 (1005 Metric); Manufacturer Part Number: CL05A106MP5NUNC; Manufacturer: Samsung Electro-Mechanics; Case/Package: 0402; Supplier-1: Digikey
C26 C27 = CAP_47pF-10V-10%-0402: 470pF ±10% 10V Ceramic Capacitor C0G, NP0 0402 (1005 Metric); Manufacturer: KEMET; Manufacturer Part Number: C0402C470K8GAC7867; Case/Package: 0402; Supplier-1: Supplier-1
C29 C31 = CAP_1uF-10V-10%-0402: 0.47µF ±10% 10V Ceramic Capacitor X6S 0402 (1005 Metric); Manufacturer: Murata Electronics; Manufacturer Part Number: GRT155C81A105KE01D; Case/Package: 0402; Supplier-1: Digikey
C30 = CAP_1uF-10V-10%-0402: as C11 on sheet Crawler_Power_V2.0; Case/Package: 0402; Supplier-1: Digikey
C32 = CAP_2.2uF-10V-10%-0402: 2.2µF ±10% 10V Ceramic Capacitor X5R 0402 (1005 Metric); Manufacturer: Murata Electronics; Manufacturer Part Number: GRM155R61A225KE95D; Case/Package: 0402; Supplier-1: Digikey
C33 = CAP_22uF-10V-20%-0603: as C10 on sheet Crawler_Power_V2.0; Case/Package: 0603; Supplier-1: Digikey
C38 = CAP_4.7uF-10V-10%-0402: as C6 on sheet Crawler_Power_V2.0; Case/Package: 0402; Supplier-1: Digikey
C40-C51 = JP3: WR-PHD 2.54 mm Angled Socket Header; Manufacturer: W¨¹rth Elektronik eiSos GmbH; partNo: 613003143121; ComponentLink1 Description: Manufacturer; ComponentLink2 Description: Datasheet; NoPins: 03; Created Date: 29 March 2013; ComponentLink1URL: http://www.we-online.com; ComponentLink2URL: http://katalog.we-online.de/em/datasheet/6130xx143121.pdf; Created by: Karrer Zheng
FB1 FB2 = CBM160808U601T: BOM_Manufacturer: FH(风华); Contributor: LCSC; BOM_Supplier: LCSC; BOM_Supplier Part: C394427; BOM_Manufacturer Part: CBM160808U601T; BOM_JLCPCB Part Class: Extended Part; spicePre: F; spiceSymbolName: CBM160808U601T
H1 = C84005: BOM_Manufacturer: BOOMELE(博穆精密); BOM_Manufacturer Part: 2.54-2*7P立贴母; Contributor: LCSC; BOM_Supplier: LCSC; BOM_Supplier Part: C84005; BOM_JLCPCB Part Class: Extended Part; spicePre: H; spiceSymbolName: C84005
IC3 = PCA9685PW,118: Integrated Circuit; Manufacturer_Name: NXP; Datasheet Link: http://www.nxp.com/docs/en/data-sheet/PCA9685.pdf; Height: 1.1mm; Manufacturer_Part_Number: PCA9685PW,118; Mouser Part Number: 771-PCA9685PW,118; Mouser Price/Stock: https://www.mouser.co.uk/ProductDetail/NXP-Semiconductors/PCA9685PW118?qs=6YAT8rHPFU%252BtfwwKq4nwEQ%3D%3D; Arrow Part Number: PCA9685PW,118; Arrow Price/Stock: https://www.arrow.com/en/products/pca9685pw118/nxp-semiconductors?region=nac
IC5 = MAX98357AEWL+T: Integrated Circuit; Manufacturer_Name: Analog Devices; Datasheet Link: https://datasheets.maximintegrated.com/en/ds/MAX98357A-MAX98357B.pdf; Height: 0.69mm; Manufacturer_Part_Number: MAX98357AEWL+T; Mouser Part Number: 700-MAX98357AEWL+T; Mouser Price/Stock: https://www.mouser.co.uk/ProductDetail/Analog-Devices-Maxim-Integrated/MAX98357AEWL%2bT?qs=ZrtEiRxEuI4mjqOyZP4d0A%3D%3D; Arrow Part Number: MAX98357AEWL+T; Arrow Price/Stock: https://www.arrow.com/en/products/max98357aewlt/maxim-integrated?region=nac
IC6 = MAX9814ETD+T: Integrated Circuit; Manufacturer_Name: Analog Devices; Datasheet Link: https://www.analog.com/MAX9814/datasheet; Height: 0.8mm; Manufacturer_Part_Number: MAX9814ETD+T; Mouser Part Number: 700-MAX9814ETDT; Mouser Price/Stock: https://www.mouser.co.uk/ProductDetail/Analog-Devices-Maxim-Integrated/MAX9814ETD%2bT?qs=1THa7WoU59HUZGorIAH%2Frw%3D%3D; Arrow Part Number: MAX9814ETD+T; Arrow Price/Stock: https://www.arrow.com/en/products/max9814etdt/maxim-integrated?region=nac
IC8 = MAX98357AETE+: Integrated Circuit; Manufacturer_Name: Maxim Integrated; Datasheet Link: https://datasheets.maximintegrated.com/en/ds/MAX98357A-MAX98357B.pdf; Height: 0.8mm; Manufacturer_Part_Number: MAX98357AETE+; Mouser Part Number: 700-MAX98357AETE+; Mouser Price/Stock: https://www.mouser.co.uk/ProductDetail/Maxim-Integrated/MAX98357AETE%2b?qs=AAveGqk956EyS6m3AmZeuw%3D%3D
L2 L4 = MLF2012C680KT000: Inductor; Manufacturer_Name: TDK; Datasheet Link: https://product.tdk.com/system/files/dam/doc/product/inductor/inductor/smd/catalog/inductor_commercial_standard_mlf2012_en.pdf; Height: 1.45mm; Manufacturer_Part_Number: MLF2012C680KT000; Mouser Part Number: 810-MLF2012C680KT000; Mouser Price/Stock: https://www.mouser.com/Search/Refine.aspx?Keyword=810-MLF2012C680KT000
LED1-LED12 = WS2812B-B: BOM_Manufacturer: worldsemi; BOM_Manufacturer Part: WS2812B-B/W; Contributor: LCSC; BOM_Supplier: LCSC; BOM_Supplier Part: C114586; BOM_JLCPCB Part Class: Extended Part; spicePre: L; spiceSymbolName: WS2812B-B
MIC1 = GMI4015P-2C-58DB: BOM_Manufacturer: INGHAi(赢海); Contributor: LCSC; BOM_Supplier: LCSC; BOM_Supplier Part: C233300; BOM_Manufacturer Part: GMI4015P-2C-58db; BOM_JLCPCB Part Class: Extended Part; spicePre: M; spiceSymbolName: GMI4015P-2C-58DB
R7 R8 = RES_4.7K-0.1W-1%-0402: 4.7 kOhms ±1% 0.1W, 1/10W Chip Resistor 0402 (1005 Metric) Automotive AEC-Q200 Thick Film; Manufacturer: Panasonic Electronic Components; Manufacturer Part Number: ERJ-2RKF4701X; Case/Package: 0402; Supplier-1: Digikey
R12 R13 R32 = RES_200K-0.1W-1%-0402: as R11 on sheet Crawler_Power_V2.0; Case/Package: 0402; Supplier-1: Digikey
R17 = RES_6.8K-0.1W-1%-0402: 680 kOhms ±1% 0.1W, 1/10W Chip Resistor 0402 (1005 Metric) Anti-Sulfur Thin Film; Manufacturer: Vishay Beyschlag/Draloric/BC Components; Manufacturer Part Number: MCS04020C6801FE000; Supplier-1: Digikey; Case/Package: 0402
R25 R26 R28 = RES_100K-0.1W-1%-0402: 300 kOhms ±1% 0.1W, 1/10W Chip Resistor 0402 (1005 Metric) Anti-Sulfur Thin Film; Manufacturer: Vishay Beyschlag/Draloric/BC Components; Manufacturer Part Number: MCS04020C1003FE000; Case/Package: 0402; Supplier-1: Digikey
R27 R30 = RES_100K-0.1W-1%-0402: 100 kOhms ±1% 0.1W, 1/10W Chip Resistor 0402 (1005 Metric) Anti-Sulfur Thin Film; Manufacturer: Vishay Beyschlag/Draloric/BC Components; Manufacturer Part Number: MCS04020C1003FE000; Case/Package: 0402; Supplier-1: Digikey
R31 = RES_100K-0.1W-1%-0402: 150 kOhms ±1% 0.1W, 1/10W Chip Resistor 0402 (1005 Metric) Anti-Sulfur Thin Film; Manufacturer: Vishay Beyschlag/Draloric/BC Components; Manufacturer Part Number: MCS04020C1003FE000; Case/Package: 0402; Supplier-1: Digikey
R35-R42 R47-R50 = RES_240R-0.1W-1%-0402: 220 Ohms ±1% 0.1W, 1/10W Chip Resistor 0402 (1005 Metric) Automotive AEC-Q200 Thick Film; Manufacturer: Panasonic Electronic Components; Manufacturer Part Number: ERJ-2RKF2400X; Case/Package: 0402; Supplier-1: Digikey
TP1 TP2 = TEST POINT: 0.4mm hole size Test point; Manufacturer Part Number: NA; Case/Package: TH; Manufacturer: NA; Supplier-1: NA
U1 = X1321WVS-2X08J-C40D53: BOM_Manufacturer: XKB Connectivity(中国星坤); Contributor: LCSC; BOM_Supplier: LCSC; BOM_Supplier Part: C2881913; BOM_Manufacturer Part: X1321WVS-2x08J-C40D53; BOM_JLCPCB Part Class: Extended Part; spicePre: U; spiceSymbolName: X1321WVS-2X08J-C40D53
U2 U3 = X1321WVS-2X03J-C40D53: BOM_Manufacturer: XKB Connectivity(中国星坤); Contributor: LCSC; BOM_Supplier: LCSC; BOM_Supplier Part: C2881908; BOM_Manufacturer Part: X1321WVS-2x03J-C40D53; BOM_JLCPCB Part Class: Extended Part; spicePre: U; spiceSymbolName: X1321WVS-2X03J-C40D53
U4 = LSM6DSLTR: Accelerometer, Gyroscope, Temperature, 6 Axis Sensor IÂ²C, SPI Output; MF: STMicroelectronics; SnapEDA_Link: https://www.snapeda.com/parts/LSM6DSLTR/STMicroelectronics/view-part/550517/?ref=snap; Availability: Unavailable; MP: LSM6DSLTR; Value: *; Price: None; Package: LGA-14 STMicroelectronics

## Nets that join several sheets
+3V3: Crawler_Power_V2.0 (C12.2 C13.2 IC2.5), Crawler_Sensor_V2.0 (17 pins)
+5V: Crawler_Power_V2.0 (9 pins), Crawler_Sensor_V2.0 (35 pins)
GND: Crawler_Power_V2.0 (54 pins), Crawler_Sensor_V2.0 (59 pins)
VBAT_SW: Crawler_Power_V2.0 (10 pins), Crawler_Sensor_V2.0 (R25.2)
VBUS: Crawler_Power_V2.0 (8 pins), Crawler_Sensor_V2.0 (R26.2)
USB_DN: Crawler_Power_V2.0 (USB1.A7 USB1.B7), Crawler_Sensor_V2.0 (U3.3)
USB_DP: Crawler_Power_V2.0 (USB1.A6 USB1.B6), Crawler_Sensor_V2.0 (U3.5)